# EAGLE design exp-ethernet (EAGLE 4.11)
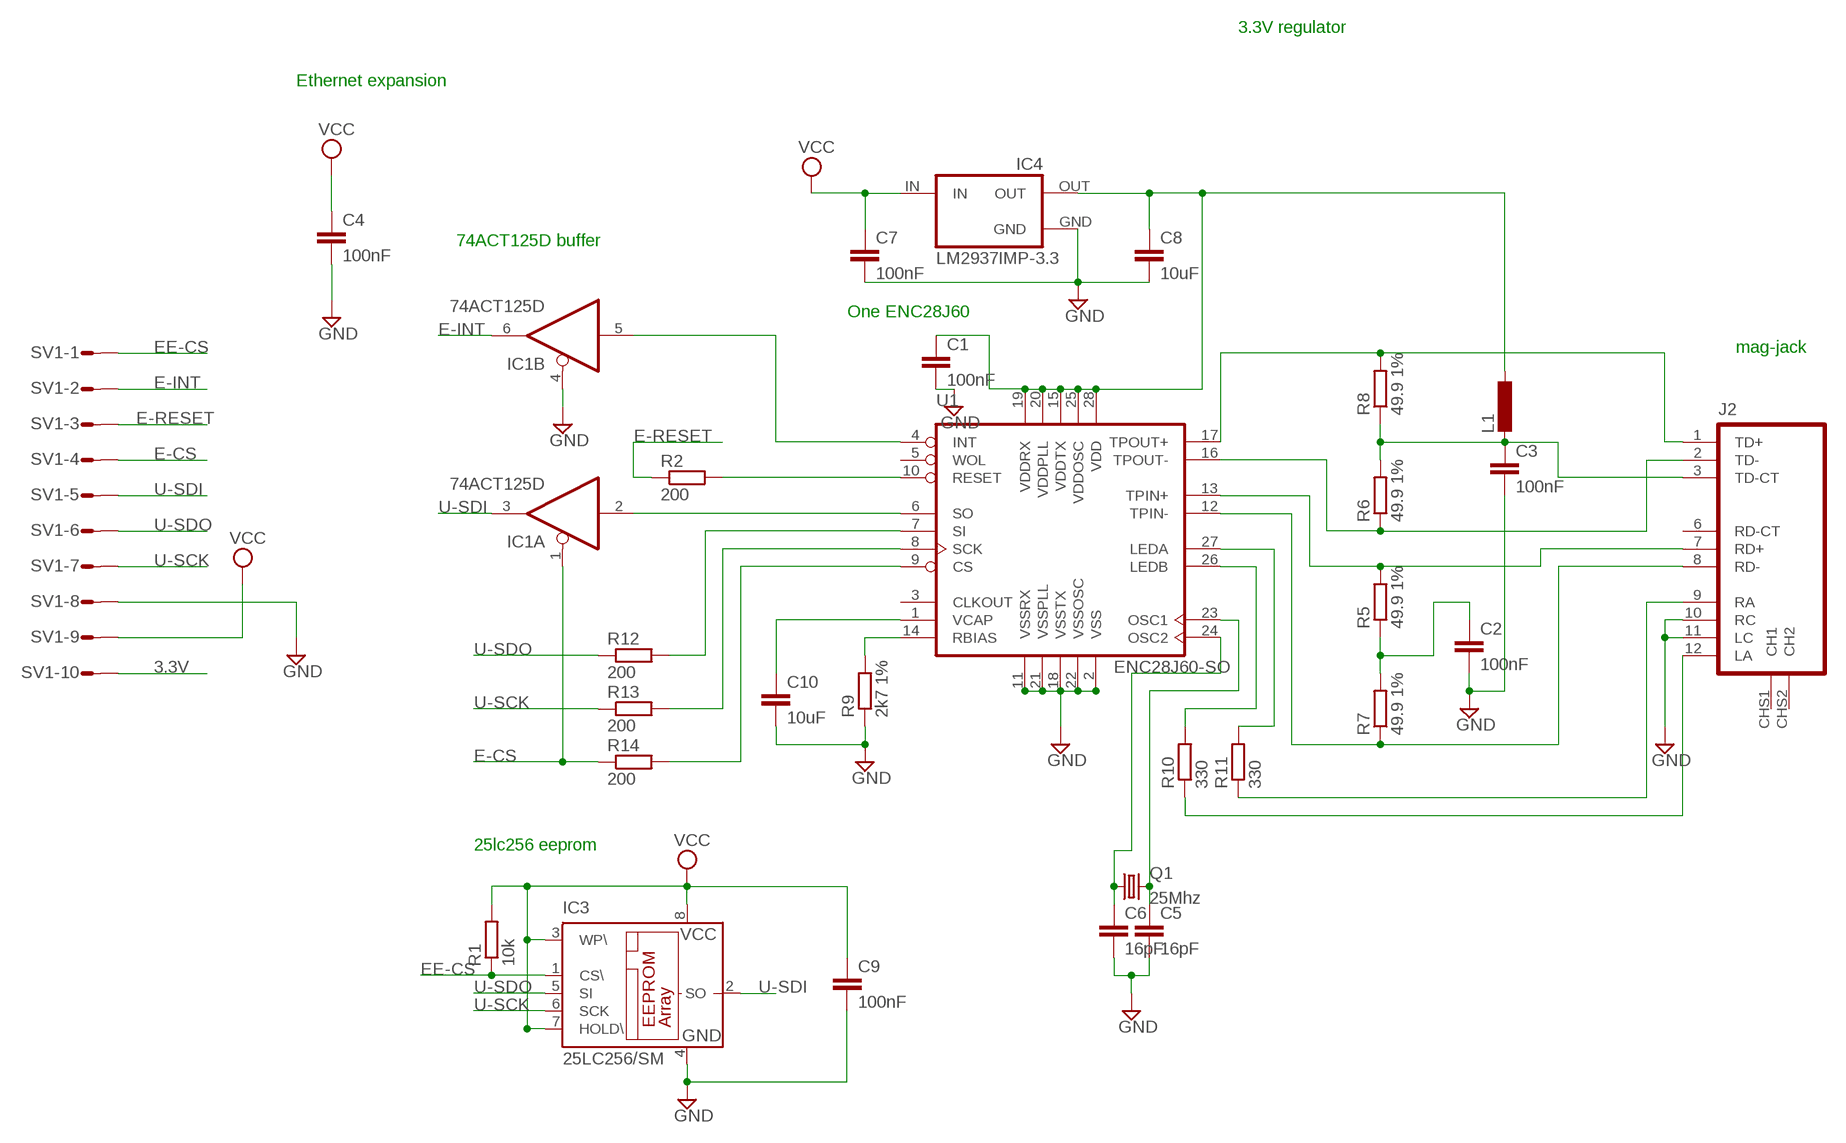
[diagram p0: schematic, sheet 1]

## Parts
C1  100nF  C-EUC0603  [C0603]
C2  100nF  C-EUC0603  [C0603]
C3  100nF  C-EUC0603  [C0603]
C4  100nF  C-EUC0603  [C0603]
C5  16pF  C-EUC0603  [C0603]
C6  16pF  C-EUC0603  [C0603]
C7  100nF  C-EUC0603  [C0603]
C8  10uF  C-EUC0603  [C0603]
C9  100nF  C-EUC0603  [C0603]
C10  10uF  C-EUC0603  [C0603]
IC1  74ACT125D  [SO14]
IC3  25LC256/SM  [SO-08M]
IC4  LM2937IMP-3.3  [SOT223]
J2  J1006F01P  [PULSEJACK-J1A]
L1  L-EUL0603  [R0603]
Q1  25Mhz  CRYTALHC49S  [HC49/S]
R1  10k  R-EU_R0603  [R0603]
R2  200  R-EU_R0603  [R0603]
R5  49.9 1%  R-EU_R0603  [R0603]
R6  49.9 1%  R-EU_R0603  [R0603]
R7  49.9 1%  R-EU_R0603  [R0603]
R8  49.9 1%  R-EU_R0603  [R0603]
R9  2k7 1%  R-EU_R0603  [R0603]
R10  330  R-EU_R0603  [R0603]
R11  330  R-EU_R0603  [R0603]
R12  200  R-EU_R0603  [R0603]
R13  200  R-EU_R0603  [R0603]
R14  200  R-EU_R0603  [R0603]
SV1  L10P  [L10P]
U1  ENC28J60-SO  [SO28W]

## Nets
3.3V: C1.1 C8.1 IC4.OUT L1.1 SV1.10 U1.15(VDDTX) U1.19(VDDRX) U1.20(VDDPLL) U1.25(VDDOSC) U1.28(VDD)
E-CS: IC1.1(A:OE) R14.1 SV1.4
E-INT: IC1.6(B:O) SV1.2
E-PRE-CS: R14.2 U1.9(CS)
E-PRE-INT: IC1.5(B:I) U1.4(INT)
E-PRE-SCK: R13.2 U1.8(SCK)
E-PRE-SI: R12.2 U1.7(SI)
E-PRE-SO: IC1.2(A:I) U1.6(SO)
E-RESET: R2.1 SV1.3
E-TPIN+: J2.7(RD+) R5.2 U1.13(TPIN+)
E-TPIN-: J2.8(RD-) R7.1 U1.12(TPIN-)
E-TPOUT+: J2.1(TD+) R8.2 U1.17(TPOUT+)
E-TPOUT-: J2.2(TD-) R6.1 U1.16(TPOUT-)
EE-CS: IC3.1(CS\) R1.1 SV1.1
GND: C1.2 C2.2 C3.2 C4.2 C5.2 C6.2 C7.2 C8.2 C9.2 C10.2 IC1.4(B:OE) IC3.4(GND) IC4.GND J2.10(RC) J2.11(LC) R9.1 SV1.8 U1.2(VSS) U1.11(VSSRX) U1.18(VSSTX) U1.21(VSSPLL) U1.22(VSSOSC)
LEDA: J2.9(RA) R11.1
LEDB: J2.12(LA) R10.1
N$1: R2.2 U1.10(RESET)
N$14: C2.1 R5.1 R7.2
OSC1: C6.1 Q1.1 U1.24(OSC2)
OSC2: C5.1 Q1.2 U1.23(OSC1)
PRE-LEDA: R11.2 U1.27(LEDA)
PRE-LEDB: R10.2 U1.26(LEDB)
PRE-VCAP: C10.1 U1.1(VCAP)
RBIAS: R9.2 U1.14(RBIAS)
TD-CT: C3.1 J2.3(TD-CT) L1.2 R6.2 R8.1
U-SCK: IC3.6(SCK) R13.1 SV1.7
U-SDI: IC1.3(A:O) IC3.2(SO) SV1.5
U-SDO: IC3.5(SI) R12.1 SV1.6
VCC: C4.1 C7.1 C9.1 IC3.3(WP\) IC3.7(HOLD\) IC3.8(VCC) IC4.IN R1.2 SV1.9
Unconnected: IC1.8(C:O) IC1.9(C:I) IC1.10(C:OE) IC1.11(D:O) IC1.12(D:I) IC1.13(D:OE) J2.6(RD-CT) J2.CHS1(CH1) J2.CHS2(CH2) U1.3(CLKOUT) U1.5(WOL)

## Notes on the sheet
- 3.3V regulator
- Ethernet expansion
- 74ACT125D buffer
- One ENC28J60
- mag-jack
- 25lc256 eeprom

## Power pins joined to a net without a drawn wire
GND: IC1.7(P:GND) IC4.GND@(GND)
VCC: IC1.14(P:VCC)

## Library data of the parts
C1-C10 = rcl:C-EU: CAPACITOR, European symbol
IC1 = 74xx-eu:74*125: Quad bus BUFFER, 3-state
IC3 = microchip:25LC256
IC4 = lm2937:LM2937IMP-*: 400 and 500 mA Low Dropout Voltage Regulator NATIONAL SEMICONDUCTOR created by Peter.Hofmann@ph-tronic.de <mailto:Reter.Hofmann@ph-tronic.de> 10-2004 Rev.0
J2 = pulsejack:J1006F01P
L1 = rcl:L-EU: INDUCTOR, European symbol
Q1 = crystal:CRYTAL: CRYSTAL
R1 R2 R5-R14 = rcl:R-EU_: RESISTOR, European symbol
SV1 = con-amp-mt:L10P: AMP MT CONNECTOR
U1 = microchip-enc28j60:ENC28J60-*: Microchip 10Mbit Eth. contoller with SPI interface

## Board
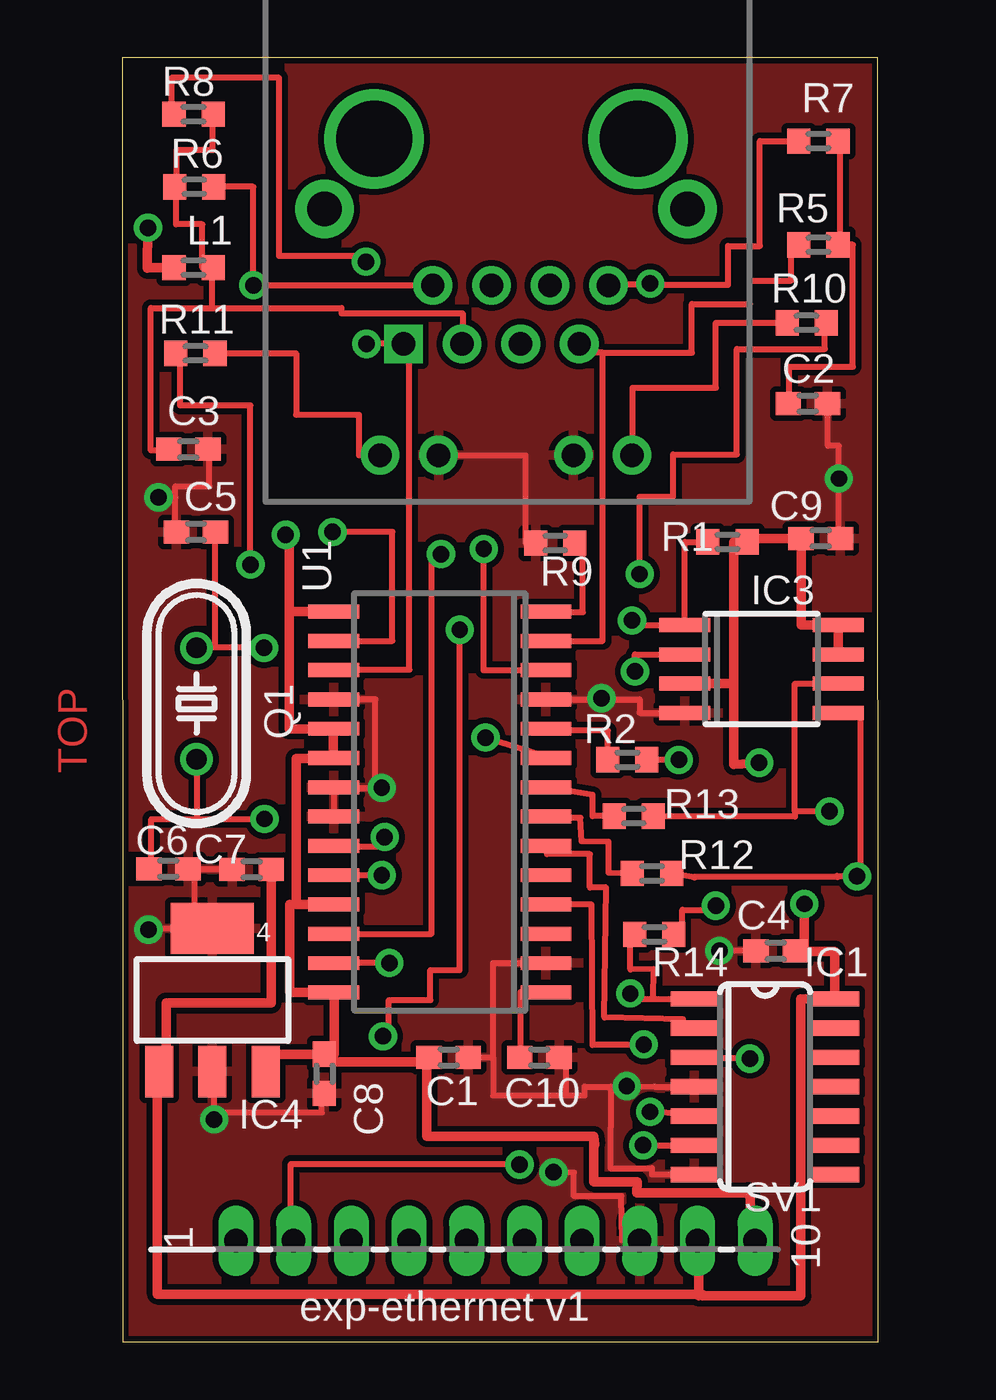
[diagram p1: board, top side]
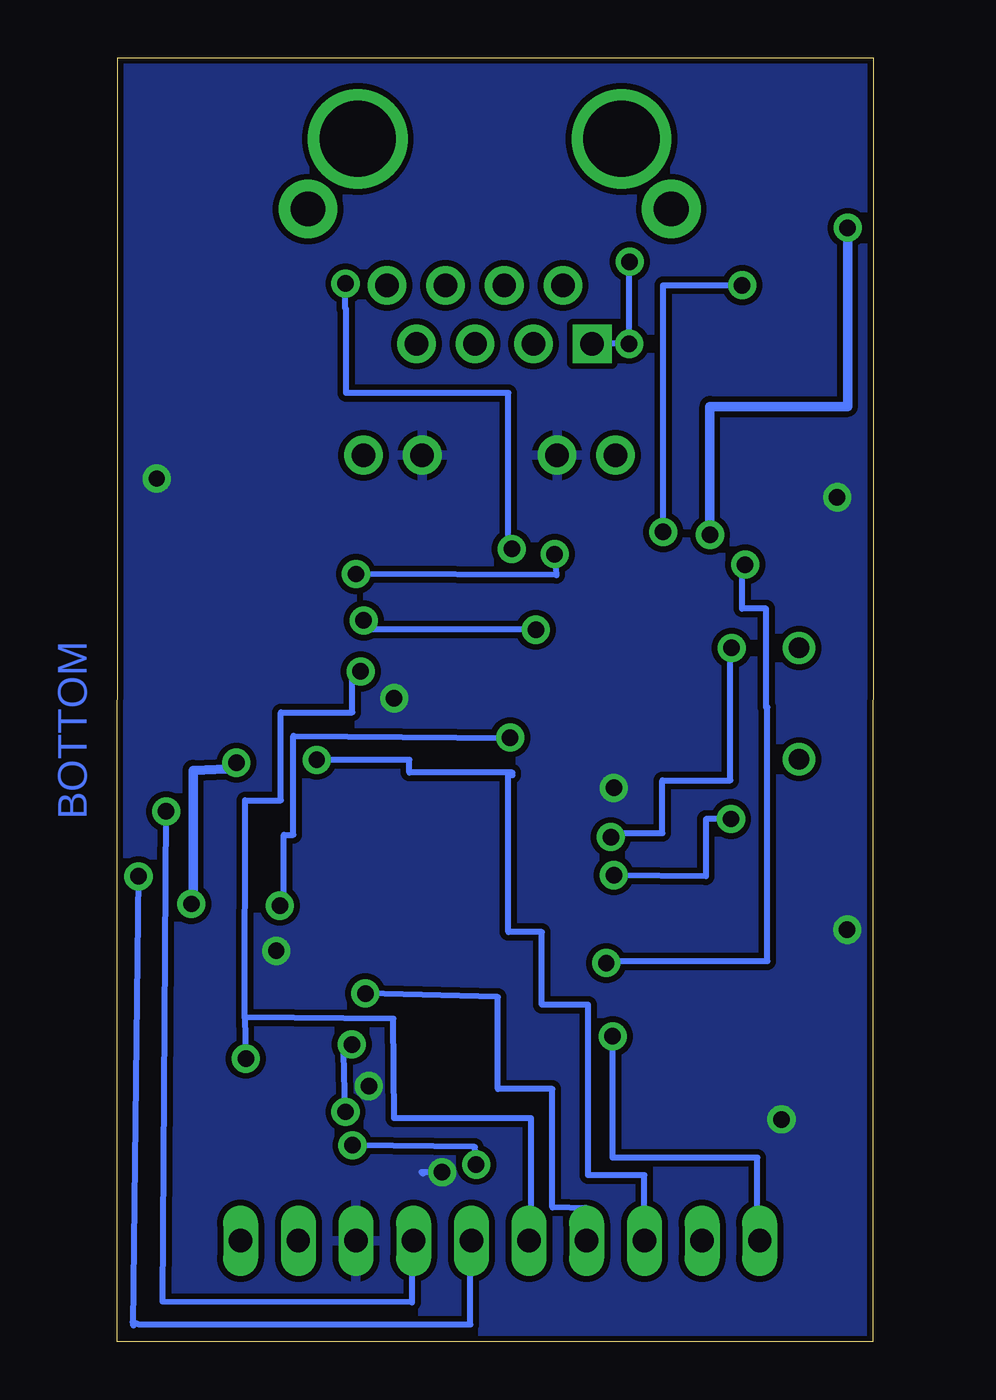
[diagram p2: board, bottom side, seen from below]

Size 32.77 x 55.68 mm. Coordinates in mm from the lower left corner, seen from the top.
Outline: 0.02,0 32.77,0 32.75,55.68 0,55.68 0.02,0
Copper layers (1*16): Top 0.035mm / dielectric 1.5mm / Bottom 0.035mm
Design rules "10mils": minimum track width 10mil, minimum drill 0.6mm, track to track 10mil, track to pad 10mil, pad to pad 10mil, via to via 10mil, smd to smd 10mil, copper to edge 10mil, drill to drill 10mil, minimum pad ring 10mil, minimum via ring 10mil, stop-mask expansion 0mil, vias tented up to drill 0mil, thermal gap 10mil

### Footprints (pad centres in the part's own frame; a part is rotated, then mirrored left to right if it is on the bottom)
C0603 = smd 1.1 x 1: 1 -0.85,0; 2 0.85,0
SO14 = smd 0.66 x 2.032: 1 -3.81,-3.073; 2 -2.54,-3.073; 3 -1.27,-3.073; 4 0,-3.073; 5 1.27,-3.073; 6 2.54,-3.073; 7 3.81,-3.073; 8 3.81,3.073; 9 2.54,3.073; 10 1.27,3.073; 11 0,3.073; 12 -1.27,3.073; 13 -2.54,3.073; 14 -3.81,3.073
SO-08M = smd 0.6 x 2.2: 1 -1.905,-3.33; 2 -0.635,-3.33; 3 0.635,-3.33; 4 1.905,-3.33; 5 1.905,3.33; 6 0.635,3.33; 7 -0.635,3.33; 8 -1.905,3.33
SOT223 = smd 1.219 x 2.235: GND 0,-3.099; IN -2.311,-3.099; OUT 2.311,-3.099 | smd 3.6 x 2.2: GND@ 0,3.099
PULSEJACK-J1A = drill 1.016 pad 1.676 square: 1 -4.445,-4.572 | drill 1.016 pad 1.676 round: 2 -3.175,-2.032; 3 -1.905,-4.572; 4 -0.635,-2.032; 5 0.635,-4.572; 6 1.905,-2.032; 7 3.175,-4.572; 8 4.445,-2.032; 9 -5.461,-9.398; 10 -2.921,-9.398; 11 2.921,-9.398; 12 5.461,-9.398 | drill 1.5 pad 2.54 round: CHS1 7.874,1.27; CHS2 -7.874,1.27 | drill 3.3 round: P$1 -5.715,4.318; P$2 5.715,4.318
R0603 = smd 1 x 1.1: 1 -0.85,0; 2 0.85,0
HC49/S = drill 0.889 round: 1 -2.413,0; 2 2.413,0
L10P = drill 1.016 long: 1 11.25,-6.25; 2 8.75,-6.25; 3 6.25,-6.25; 4 3.75,-6.25; 5 1.25,-6.25; 6 -1.25,-6.25; 7 -3.75,-6.25; 8 -6.25,-6.25; 9 -8.75,-6.25; 10 -11.25,-6.25
SO28W = smd 0.6 x 2.2: 1 -8.255,-4.6; 2 -6.985,-4.6; 3 -5.715,-4.6; 4 -4.445,-4.6; 5 -3.175,-4.6; 6 -1.905,-4.6; 7 -0.635,-4.6; 8 0.635,-4.6; 9 1.905,-4.6; 10 3.175,-4.6; 11 4.445,-4.6; 12 5.715,-4.6; 13 6.985,-4.6; 14 8.255,-4.6; 15 8.255,4.6; 16 6.985,4.6; 17 5.715,4.6; 18 4.445,4.6; 19 3.175,4.6; 20 1.905,4.6; 21 0.635,4.6; 22 -0.635,4.6; 23 -1.905,4.6; 24 -3.175,4.6; 25 -4.445,4.6; 26 -5.715,4.6; 27 -6.985,4.6; 28 -8.255,4.6

### Placement (x,y rotation side)
C1  14.14,12.33 0 top
C2  29.71,40.68 0 top
C3  2.87,38.7 0 top
C4  28.32,16.95 180 top
C5  3.2,35.12 180 top
C6  2,20.51 0 top
C7  5.61,20.49 180 top
C8  8.76,11.62 270 top
C9  30.27,34.84 0 top
C10  18.08,12.33 0 top
IC1  27.86,11.06 270 top
IC3  27.71,29.17 270 top
IC4  3.91,14.82 0 top
J2  16.63,47.84 0 top
L1  3.09,46.57 0 top
Q1  3.22,27.67 90 top
R1  26.23,34.68 0 top
R2  21.89,25.23 180 top
R5  30.17,47.56 180 top
R6  3.12,50.08 180 top
R7  30.17,52.06 0 top
R8  3.09,53.23 180 top
R9  18.77,34.63 0 top
R10  29.66,44.18 0 top
R11  3.17,42.86 180 top
R12  22.96,20.31 180 top
R13  22.17,22.8 180 top
R14  23.06,17.67 0 top
SV1  16.17,-1.87 180 top
U1  13.76,23.41 90 top

### Tracks (layer width: path | path; a pad name or v marks a point on that pad's centre or on a via)
3.3V  (via drill 0.71)
  Top 0.254: 6.24,12.47 6.24,12.46 6.22,12.46 IC4.OUT | IC4.OUT 6.22,11.7 | IC4.OUT | 9.19,15.15 U1.28 | 9.19,12.47 C8.1 8.78,12.14 | 12.87,12.43 13.21,12.35 | 13.21,12.35 C1.1 | 12.92,12.13 12.87,12.43 | 12.87,12.43 13,12.48 | 7.23,31.59 7.23,31.61 | 7.23,31.61 7.23,31.66 | 9.16,26.56 U1.19 9.14,26.58 | 9.14,25.29 9.14,25.31 U1.20 | 1.09,46.55 1.09,46.57 | 7.23,31.61 7.18,31.61 | 7.23,34.99 v7.08,34.99 | 27.22,4.38 SV1.10 | 27.22,6.26 27.12,6.26 27.12,6.46 | 13.21,12.35 13.2,12.35 | 7.26,18.96 7.54,18.96
  Top 0.406: 6.24,12.47 C8.1 | 9.19,12.47 9.19,15.15 | 8.78,12.14 12.92,12.13 | 7.23,31.66 U1.15 | U1.19 7.23,26.58 7.23,31.59 7.23,34.99 | 9.14,25.31 9.14,26.58 | 9.14,25.29 7.54,25.29 7.54,18.96 U1.25 | 1.09,46.57 L1.1 | v1.11,48.3 1.09,46.55 | 27.22,6.26 27.22,4.38 | 20.44,8.9 13.2,8.9 13.2,12.35 | 20.44,8.9 20.47,8.55 | 20.44,8.9 20.44,6.95 22.32,6.95 22.3,6.46 27.12,6.46 | U1.28 7.26,15.15 7.26,18.96
  Bottom 0.406: v1.11,48.3 1.11,40.55 7.08,40.55 v7.08,34.99
E-CS  (via drill 0.71)
  Top 0.254: R14.1 22.02,17.67 22.02,16.14 23.03,16.17 23.01,14.87 | 23.01,14.87 IC1.1 | 23.01,14.87 21.94,14.87 v22.02,15.1
  Bottom 0.254: v22.02,15.1 16.28,14.95 16.28,10.96 13.91,10.96 13.91,5.83 12.39,5.78 12.44,4.38 | 12.44,4.38 12.44,4.36 | SV1.4 12.44,4.38
E-INT  (via drill 0.71)
  Top 0.254: SV1.2 7.31,4.38 7.31,7.71 17.14,7.71 v17.22,7.68 | 24.43,8.52 IC1.6 | v22.58,8.52 24.43,8.52 | 24.43,8.52 24.43,8.5
  Bottom 0.254: SV1.2 7.34,4.38 | v17.22,7.68 17.22,7.73 17.27,8.45 v22.58,8.52
E-PRE-CS  (via drill 0.71)
  Top 0.254: R14.2 24.28,17.67 24.28,18.73 25.72,18.73 v25.72,18.91 | 18.69,25.29 18.69,25.31 U1.9 | v15.74,26.2 18.69,25.29 | 18.69,25.29 18.69,25.16
  Bottom 0.254: v25.72,18.91 25.55,18.91 25.55,21.98 25.14,21.98 25.14,26.28 15.69,26.17 v15.74,26.2
E-PRE-INT  (via drill 0.71)
  Top 0.254: U1.4 20.34,18.96 20.39,12.87 22.63,12.87 v22.6,12.89 | IC1.5 24.66,9.79 24.66,9.87 v22.88,9.97
  Bottom 0.254: v22.6,12.89 22.96,12.54 v22.88,9.97
E-PRE-SCK
  Top 0.254: R13.2 20.39,22.8 20.39,23.71 18.46,24.04 | 18.46,24.04 U1.8 | 18.46,24.04 18.46,24.02
E-PRE-SI
  Top 0.254: R12.2 21.08,20.33 21.08,21.68 19.91,21.7 19.86,22.72 18.33,22.72 18.33,22.77 U1.7
E-PRE-SO
  Top 0.254: IC1.2 24.3,13.6 24.3,13.98 20.9,14.06 20.97,19.7 20.26,19.7 20.26,21.15 18.41,21.15 18.41,21.5 U1.6
E-RESET  (via drill 0.71)
  Top 0.254: v24.12,25.23 R2.1
  Bottom 0.254: v24.12,25.23 20.11,25.23 20.11,24.68 15.64,24.68 15.64,24.58 15.82,24.58 15.82,17.77 14.37,17.77 14.37,14.62 12.37,14.62 12.37,7.23 9.93,7.23 SV1.3 | SV1.3 9.93,4.3 | SV1.3
E-TPIN+
  Top 0.254: R5.2 29,47.56 29,46.01 27.2,46.01 27.2,45 24.68,45 24.68,42.89 20.82,42.89 | 20.82,42.89 19.81,42.89 J2.7 | U1.13 20.82,30.39 20.82,42.89
E-TPIN-  (via drill 0.71)
  Top 0.254: R7.1 27.63,52.06 27.63,47.51 26.26,47.51 26.26,45.83 22.88,45.83 | J2.8 21.08,45.83 22.88,45.83 | U1.12 15.67,29.12 v15.67,34.38 | 22.88,45.83 22.88,45.78 | v22.88,45.88 22.88,45.83
  Bottom 0.254: v15.67,34.38 15.62,34.38 15.62,34.56 15.82,34.56 15.82,41.13 22.85,41.13 22.85,44.79 22.88,44.79 v22.88,45.88
E-TPOUT+  (via drill 0.71)
  Top 0.254: R8.2 2.13,53.23 2.13,54.8 6.8,54.8 6.8,47.08 10.56,47.08 v10.56,46.83 | v10.59,43.27 12.44,43.27 12.44,29.15 9.21,29.15 9.21,29.12 U1.17
  Bottom 0.254: v10.56,46.83 10.59,46.83 v10.59,43.27 J2.1
E-TPOUT-  (via drill 0.71)
  Top 0.254: J2.2 v5.69,45.81 5.69,50.08 3.93,50.08 | 3.93,50.08 R6.1 | 3.93,50.08 3.93,50.05 | v9.11,35.12 11.7,35.12 11.7,30.39 U1.16 9.06,30.39
  Bottom 0.254: v5.69,45.81 9.11,45.81 v9.11,35.12
EE-CS  (via drill 0.71)
  Top 0.254: IC3.1 | R1.1 24.38,34.68 IC3.1 | IC3.1 22.07,31.08 v22.09,31.28 | v11.3,13.25 11.55,13.25 11.55,14.82 13.36,14.82 13.36,16.12 14.62,16.12 v14.62,30.87
  Bottom 0.254: v22.09,31.28 21.99,31.13 21.99,30.87 v14.62,30.87 | SV1.1 5.02,4.38 5.02,7.99 11.3,7.99 v11.3,13.25
GND  (via drill 0.71)
  Top 0.254: C9.2 31.06,34.84 v31.06,37.43 31.06,38.85 30.58,38.85 C2.2 | C2.2 30.58,40.7 | C2.2 | C3.2 3.78,38.7 3.78,37.1 2.31,37.1 2.31,36.61 | 2.31,35.12 2.31,35.04 | C5.2 2.31,35.12 | 2.31,35.12 2.31,36.61 | 2.31,36.61 v1.57,36.61 | 3.15,20.51 C6.2 | 3.15,20.51 3.15,17.92 IC4.GND@ 1.14,17.92 v1.14,17.87 | C7.2 5.1,20.48 5.1,20.51 3.15,20.51 | IC4.GND 3.98,11.72 3.98,9.94 | v3.98,9.64 3.98,9.94 | C4.2 v25.88,16.96 | C8.2 8.66,10.77 8.66,9.94 3.98,9.94 | 3.98,9.94 3.96,9.94 | 22.02,11.04 22.09,11.06 | 24.56,11.06 IC1.4 23.06,11.06 | 23.06,11.06 22.02,11.04 | 23.06,11.06 24.56,11.06 | 24.56,11.06 24.56,11.04 | v21.86,11.09 23.06,11.06 | 17.95,34.81 17.95,34.63 R9.1 17.47,34.63 17.47,38.44 16.2,38.44 | 13.66,38.44 J2.10 16.2,38.44 | 16.2,38.44 16.25,38.44 | U1.18 10.97,27.85 10.97,24.02 9.19,24.02 9.19,24.04 | v11.25,24.02 U1.21 9.19,24.04 | U1.22 9.19,22.77 9.19,24.04 | IC3.4 22.42,27.27 22.42,27.85 U1.11 20.77,27.85 v20.77,27.9 | SV1.8 22.42,4.36 | SV1.8 | C1.2 16.07,12.33 | 16.07,12.33 16.07,10.68 19.25,10.68 | 22.14,11.04 22.02,11.04 | 19.25,10.68 20.04,10.68 20.04,11.06 21.18,11.06 | 22.14,11.04 22.2,11.04 | C10.2 19.25,12.33 19.25,10.68 | U1.2 16.07,16.42 16.07,12.33 | SV1.8 21.66,4.38 21.64,6.31 19.58,6.31 19.58,7.33 v18.69,7.35 | IC1.7 22.96,7.25 22.96,7.53 21.15,7.53 21.18,11.06 | 23.06,11.06 22.14,11.04 | v21.86,11.09 22.14,11.04 | 21.18,11.06 v21.86,11.09
  Bottom 0.254: v31.06,37.43 31.06,37.66 | v1.57,36.61 1.11,36.61 1.11,36.49 | v3.98,9.64 3.98,9.34 | v1.14,17.87 1.14,17.89 | v25.88,16.96 25.62,16.96 25.62,16.9 | v11.25,24.02 11.17,24.04 | v20.77,27.9 20.85,27.9 20.85,28.23 | v18.69,7.35 19.58,7.35 19.53,7.3
  pour Bottom (isolate 0.254): 0.25,55.38 0.25,0.29 32.48,0.29 32.48,55.38
  pour Top: 0.27,55.36 0.25,0.27 32.51,0.29 32.53,55.41
LEDA
  Top 0.254: J2.9 10.26,38.44 10.26,40.2 7.54,40.2 7.54,42.86 R11.1 | R11.1 | R11.1 4.01,42.81
LEDB
  Top 0.254: R10.1 25.72,44.18 25.72,41.36 22.12,41.36 22.12,38.44 | 22.12,38.44 22.12,38.39 | J2.12 22.12,38.44
N$1
  Top 0.254: R2.2 21.05,25.23 21.05,26.51 18.46,26.51 18.46,26.58 U1.10
N$14
  Top 0.254: 31.11,47.56 31.11,47.44 | 31.11,47.56 R5.1 31.67,47.56 31.67,42.28 28.9,42.28 28.9,40.68 | R7.2 31.11,52.06 31.11,47.56 | 28.9,40.68 28.9,40.55 | C2.1 28.9,40.68
OSC1  (via drill 0.71)
  Top 0.254: Q1.1 3.25,25.26 3.25,22.67 | 1.27,20.51 1.27,20.48 | C6.1 1.27,20.51 | 3.25,22.67 1.27,22.67 1.27,20.51 | 3.25,22.67 v6.17,22.67 | U1.24 | v11.25,20.23 U1.24 | U1.24 9.16,20.21
  Bottom 0.254: v6.17,22.67 7.26,22.67 7.26,20.18 11.22,20.23 v11.25,20.23
OSC2  (via drill 0.71)
  Top 0.254: C5.1 4.03,35.12 4.03,30.11 | Q1.2 3.3,30.11 4.03,30.11 | 4.03,30.11 6.42,30.11 v6.14,30.09 | v11.37,21.88 11.4,21.88 11.4,21.48 9.16,21.48 U1.23
  Bottom 0.254: v6.14,30.09 6.42,30.04 6.19,30.04 6.19,24.35 9.14,24.35 9.14,22.06 11.37,22.06 v11.37,21.88
PRE-LEDA  (via drill 0.71)
  Top 0.254: R11.2 2.51,42.86 2.51,40.6 5.56,40.6 v5.56,33.69 | 9.09,16.42 U1.27 | v11.58,16.42 9.09,16.42 | 9.09,16.42 9.09,16.4
  Bottom 0.254: v5.56,33.69 5.69,33.69 5.69,31.79 4.64,31.79 4.64,27.52 4.59,27.52 4.59,16.5 11.58,16.5 v11.58,16.42
PRE-LEDB  (via drill 0.71)
  Top 0.254: R10.2 30.45,44.18 30.45,43.04 26.64,43.04 26.64,38.47 23.87,38.47 23.87,36.64 22.42,36.64 v22.42,33.29 | v13.81,34.15 13.41,34.15 13.41,17.69 U1.26 8.94,17.69
  Bottom 0.254: v22.42,33.29 22.32,33.24 22.4,33.29 13.74,33.24 v13.81,34.15
PRE-VCAP
  Top 0.254: C10.1 17.27,12.33 17.27,15.15 U1.1
RBIAS
  Top 0.254: R9.2 19.96,34.63 19.96,31.64 18.43,31.64 18.43,31.66 | 18.43,31.66 18.43,31.74 | U1.14 18.43,31.66
TD-CT
  Top 0.254: R8.1 3.93,53.23 3.93,51.68 2.36,51.68 2.36,50.08 R6.2 2.33,50.08 | 2.33,50.08 2.33,50.1 | 2.33,50.08 2.33,48.45 3.48,48.45 3.48,46.57 L1.2 3.91,46.57 3.91,44.82 | J2.3 14.75,43.27 14.75,44.59 9.5,44.59 9.5,44.82 3.91,44.82 | 3.91,44.82 1.24,44.82 1.24,38.65 1.82,38.65 1.82,38.7 C3.1
U-SCK  (via drill 0.71)
  Top 0.254: IC3.6 29.15,28.54 29.15,23 | 29.15,23 29.15,22.77 23.01,22.77 23.01,22.8 R13.1 | v30.65,23 29.15,23
  Bottom 0.254: SV1.7 19.98,4.38 19.98,1.71 30.8,1.74 v30.65,23
U-SDI  (via drill 0.71)
  Top 0.254: IC3.2 22.22,29.81 v22.22,29.07 | IC1.3 24.53,12.33 24.53,12.28 24.12,12.28 | v27.2,12.28 24.12,12.28 | 24.12,12.28 24.15,12.21
  Bottom 0.254: v22.22,29.07 22.24,29.07 22.24,28.84 22.58,28.84 22.58,27.29 25.67,27.29 25.67,23.48 27.22,23.48 27.25,14.06 | 27.25,14.06 v27.2,12.28 | SV1.5 14.83,4.38 14.83,9.69 20.77,9.69 20.8,14.01 27.25,14.06
U-SDO  (via drill 0.71)
  Top 0.254: IC3.5 32,27.27 32,20.21 | 32,20.21 31.01,20.16 24.76,20.16 24.81,20.13 R12.1 | 32,20.21 30.98,20.21 30.98,20.18 v31.85,20.18
  Bottom 0.254: SV1.6 17.47,4.38 17.47,0.75 31.82,0.75 32.1,0.85 32.08,0.7 v31.85,20.18
VCC  (via drill 0.71)
  Top 0.254: 30.88,14.87 IC1.14 | 29.33,16.93 29.33,16.96 C4.1 29.56,16.96 | 24.99,4.38 SV1.9 | 24.99,1.99 25.14,1.99 25.14,2.07 | IC3.8 | IC3.7 | C9.1 29.43,34.84 | 27.2,34.84 27.2,34.68 R1.2 26.51,34.68 | IC3.3 24.35,28.54 | 26.51,28.59 26.51,28.54 | 1.52,11.72 IC4.IN 1.9,11.72 | 6.45,20.48 C7.1
  Top 0.406: 29.33,16.93 30.88,16.93 30.88,14.87 29.41,14.87 29.41,1.99 25.14,1.99 | 24.99,1.99 24.99,4.38 | IC3.8 IC3.7 | IC3.8 29.43,31.08 29.43,34.84 | 27.2,34.84 C9.1 | 26.51,28.54 IC3.3 | 26.51,34.68 26.51,28.59 26.51,25.03 v27.6,25.11 | 1.52,11.72 1.52,2.07 25.14,2.07 | 1.9,11.72 1.9,14.69 6.45,14.69 6.45,20.48 | 29.56,16.96 v29.56,18.99
  Bottom 0.254: v29.56,18.99 29.48,18.91 | 27.5,24.85 v27.6,25.11
  Bottom 0.406: 29.48,18.91 29.48,24.78 27.5,24.85

### Text on the board
Top: TOP
Bottom: BOTTOM
tNames: exp-ethernet v1